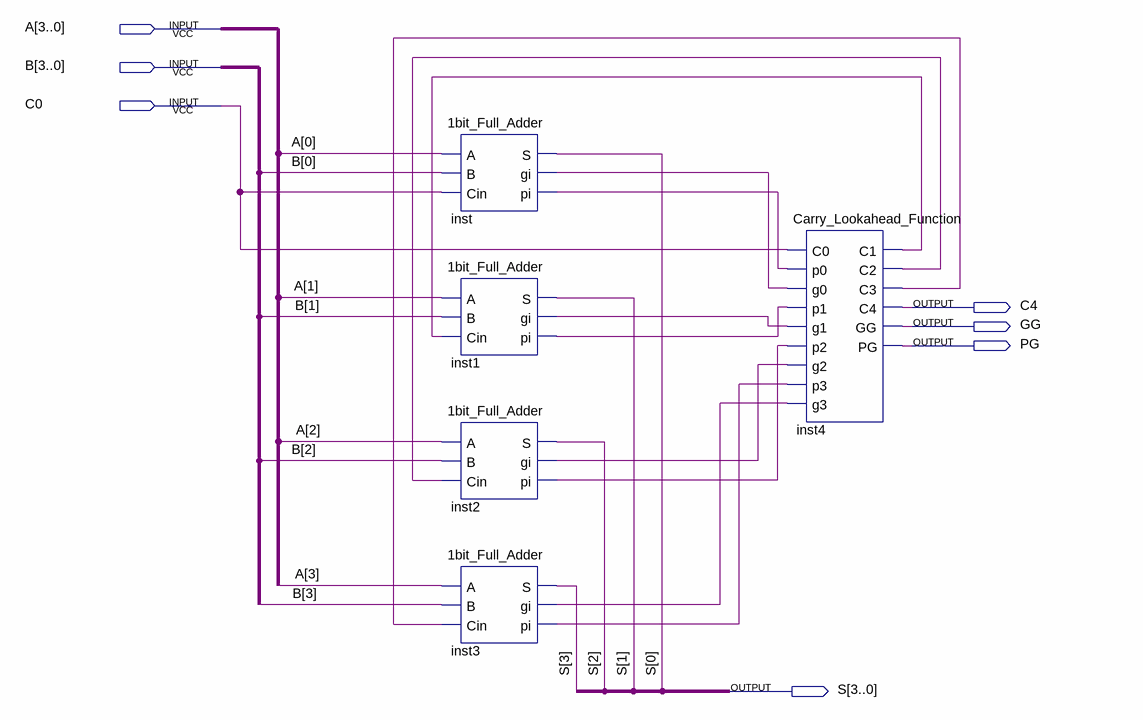
[diagram p0: schematic sheet]
// Quartus schematic 4_bit_Carry_Lookahead.bdf as structural Verilog: 5 symbols, 7 pins
module \4_bit_Carry_Lookahead  (
  input  [3:0] A,
  input  [3:0] B,
  input  C0,
  output C4,
  output GG,
  output PG,
  output [3:0] S
);

  wire inst1_gi, inst1_pi, inst2_gi, inst2_pi, inst3_gi, inst3_pi, inst4_c1, inst4_c2, inst4_c3, inst_gi,
       inst_pi;

  \1bit_Full_Adder  inst (.A(A[0]), .B(B[0]), .Cin(C0), .S(S[0]), .gi(inst_gi), .pi(inst_pi));
  \1bit_Full_Adder  inst1 (.A(A[1]), .B(B[1]), .Cin(inst4_c1), .S(S[1]), .gi(inst1_gi), .pi(inst1_pi));
  \1bit_Full_Adder  inst2 (.A(A[2]), .B(B[2]), .Cin(inst4_c2), .S(S[2]), .gi(inst2_gi), .pi(inst2_pi));
  \1bit_Full_Adder  inst3 (.A(A[3]), .B(B[3]), .Cin(inst4_c3), .S(S[3]), .gi(inst3_gi), .pi(inst3_pi));
  Carry_Lookahead_Function inst4 (
    .C0(C0), .p0(inst_pi), .g0(inst_gi), .p1(inst1_pi), .g1(inst1_gi), .p2(inst2_pi), .g2(inst2_gi),
    .p3(inst3_pi), .g3(inst3_gi), .C1(inst4_c1), .C2(inst4_c2), .C3(inst4_c3), .C4(C4), .GG(GG), .PG(PG));
endmodule
